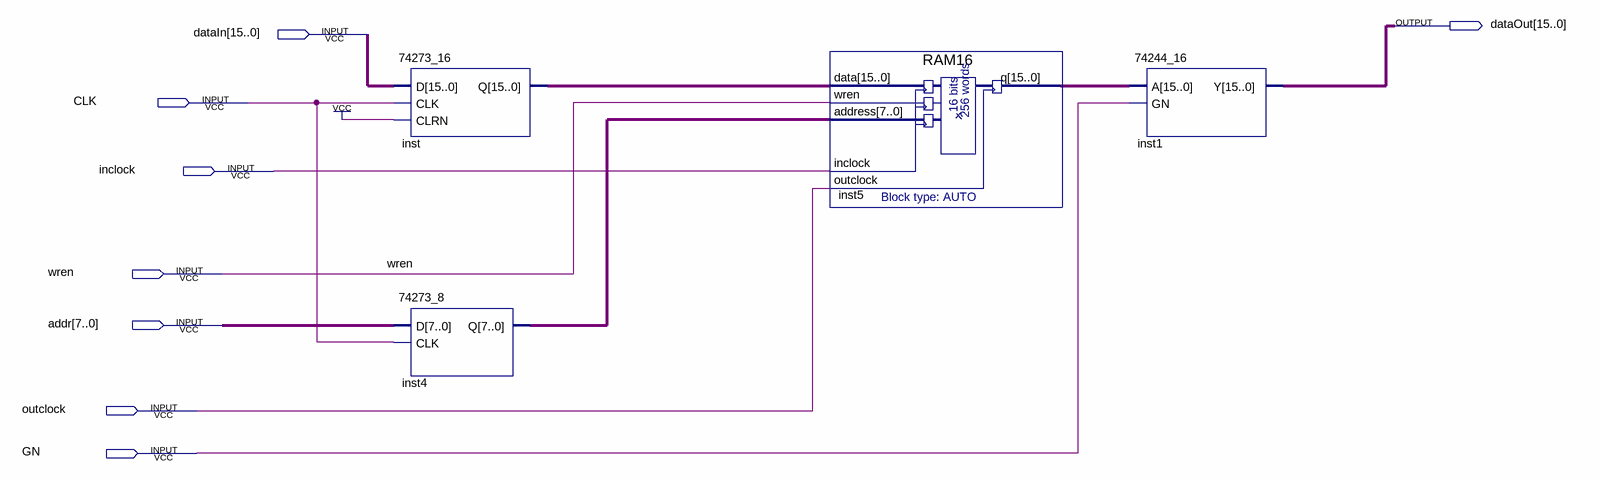
[diagram p0: schematic sheet]
// Quartus schematic A3RAM.bdf as structural Verilog: 4 symbols, 8 pins
module A3RAM (
  input  [15:0] dataIn,
  input  CLK,
  input  inclock,
  input  wren,
  input  [7:0] addr,
  input  outclock,
  input  GN,
  output [15:0] dataOut
);

  wire [7:0] inst4_q;
  wire [15:0] inst5_q, inst_q;

  \74273_16  inst (.D(dataIn), .CLK(CLK), .CLRN(1'b1), .Q(inst_q));
  \74273_8  inst4 (.D(addr), .CLK(CLK), .Q(inst4_q));
  RAM16 inst5 (.data(inst_q), .wren(wren), .address(inst4_q), .inclock(inclock), .outclock(outclock), .q(inst5_q));
  \74244_16  inst1 (.A(inst5_q), .GN(GN), .Y(dataOut));
endmodule
